# Altium schematic sheet Sheet_1_2021-05-21.schdoc
size 338 x 179 mm
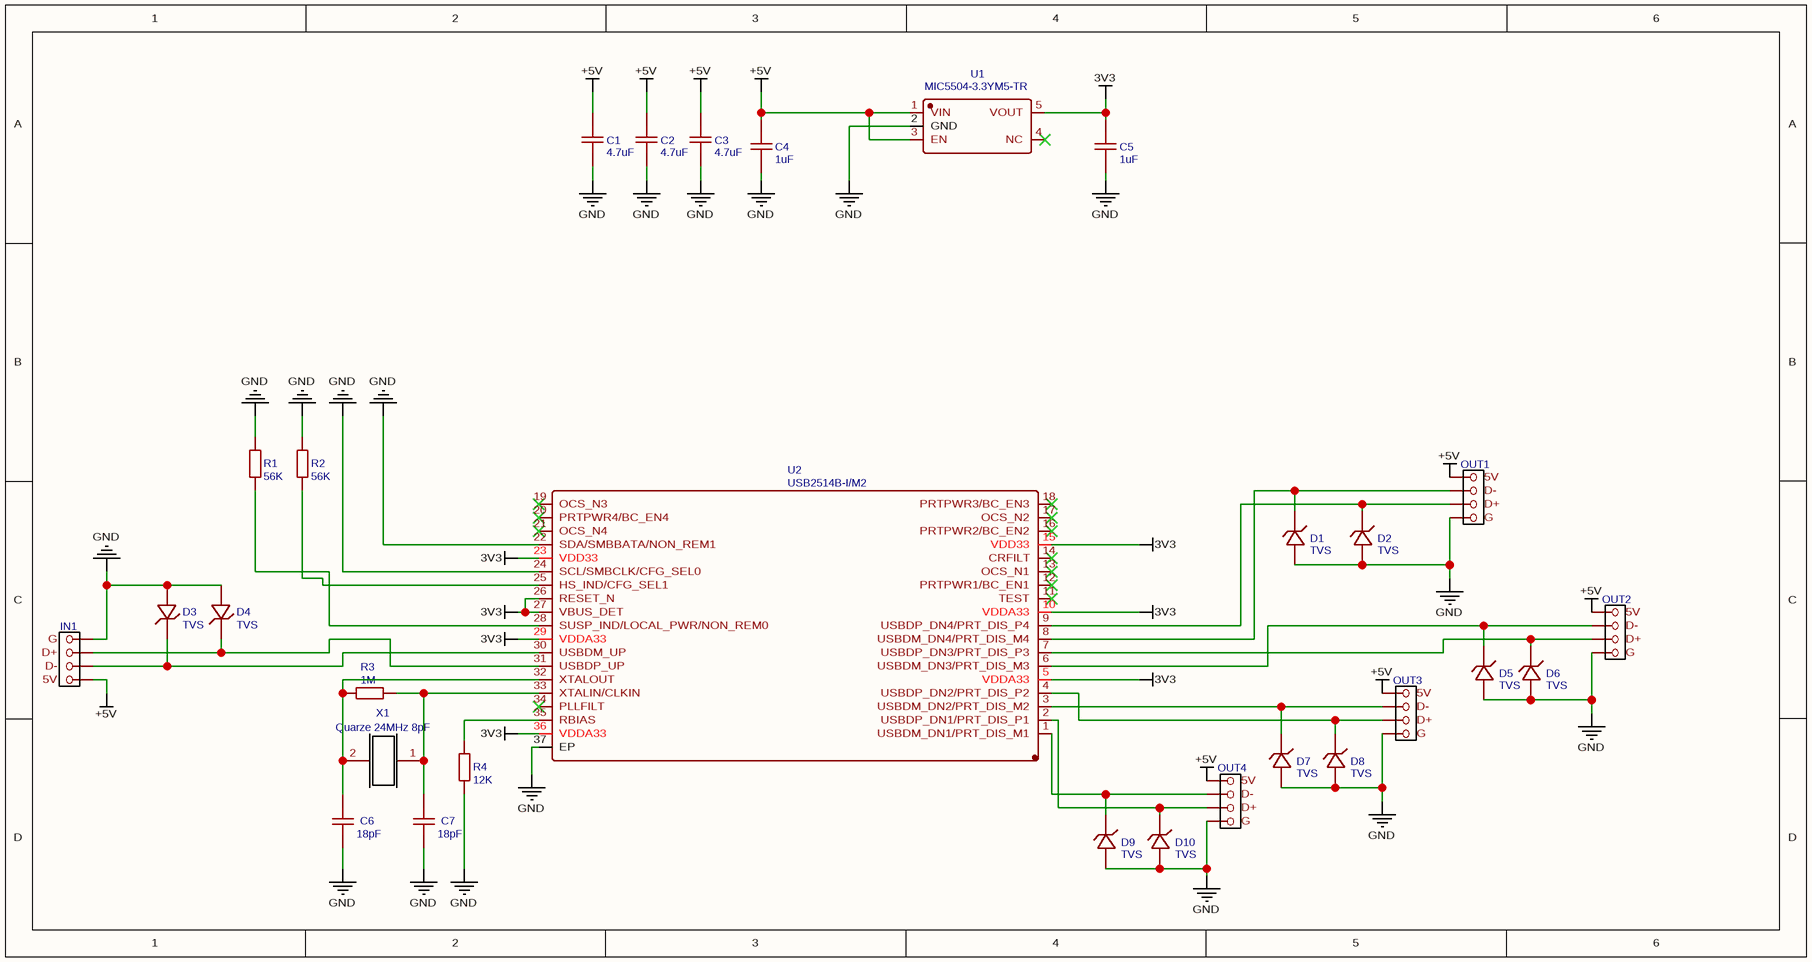
[diagram p0: Sheet_1_2021-05-21.schdoc]

## Parts
C1  4.7uF  [C0603]
C2  4.7uF  [C0603]
C3  4.7uF  [C0603]
C4  1uF  [C0603]
C5  1uF  [C0603]
C6  18pF  [C0603]
C7  18pF  [C0603]
D1  TVS  [DFN1610-2L_L1.6-W1.0-P1.10-RD]
D2  TVS  [DFN1610-2L_L1.6-W1.0-P1.10-RD]
D3  TVS  [DFN1610-2L_L1.6-W1.0-P1.10-RD]
D4  TVS  [DFN1610-2L_L1.6-W1.0-P1.10-RD]
D5  TVS  [DFN1610-2L_L1.6-W1.0-P1.10-RD]
D6  TVS  [DFN1610-2L_L1.6-W1.0-P1.10-RD]
D7  TVS  [DFN1610-2L_L1.6-W1.0-P1.10-RD]
D8  TVS  [DFN1610-2L_L1.6-W1.0-P1.10-RD]
D9  TVS  [DFN1610-2L_L1.6-W1.0-P1.10-RD]
D10  TVS  [DFN1610-2L_L1.6-W1.0-P1.10-RD]
IN1  EXT-JST  [XH-4A]  (value not drawn)
OUT1  EXT-JST  [XH-4A]  (value not drawn)
OUT2  EXT-JST  [XH-4A]  (value not drawn)
OUT3  EXT-JST  [XH-4A]  (value not drawn)
OUT4  EXT-JST  [XH-4A]  (value not drawn)
R1  56K  [R0603]
R2  56K  [R0603]
R3  1M  [R0603]
R4  12K  [R0603]
U1  MIC5504-3.3YM5-TR  [SOT-23-5_L3.0-W1.7-P0.95-LS2.8-TL]
U2  USB2514B-I/M2  [SQFN-36_L6.0-W6.0-P0.50-BL-EP]
X1  Quarze 24MHz 8pF  [24MHZ CRYSTAL]

## Nets
3V3: C5.1 U1.5(VOUT) U2.5(VDDA33) U2.10(VDDA33) U2.15(VDD33) U2.23(VDD33) U2.26(RESET_N) U2.27(VBUS_DET) U2.29(VDDA33) U2.36(VDDA33)
+5V: C1.1 C2.1 C3.1 C4.1 IN1.1(5V) OUT1.1(5V) OUT2.1(5V) OUT3.1(5V) OUT4.1(5V) U1.1(VIN) U1.3(EN)
GND: C1.2 C2.2 C3.2 C4.2 C5.2 C6.1 C7.1 D1.2 D2.2 D3.2 D4.2 D5.2 D6.2 D7.2 D8.2 D9.2 D10.2 IN1.4(G) OUT1.4(G) OUT2.4(G) OUT3.4(G) OUT4.4(G) R1.1 R2.1 R4.2 U1.2(GND) U2.22(SDA/SMBBATA/NON_REM1) U2.24(SCL/SMBCLK/CFG_SEL0) U2.37(EP)
NetC6_2: C6.2 R3.1 U2.32(XTALOUT) X1.2
NetC7_2: C7.2 R3.2 U2.33(XTALIN/CLKIN) X1.1
NetD1_1: D1.1 OUT1.2(D-) U2.8(USBDM_DN4/PRT_DIS_M4)
NetD2_1: D2.1 OUT1.3(D+) U2.9(USBDP_DN4/PRT_DIS_P4)
NetD3_1: D3.1 IN1.2(D-) U2.30(USBDM_UP)
NetD4_1: D4.1 IN1.3(D+) U2.31(USBDP_UP)
NetD5_1: D5.1 OUT2.2(D-) U2.6(USBDM_DN3/PRT_DIS_M3)
NetD6_1: D6.1 OUT2.3(D+) U2.7(USBDP_DN3/PRT_DIS_P3)
NetD7_1: D7.1 OUT3.2(D-) U2.3(USBDM_DN2/PRT_DIS_M2)
NetD8_1: D8.1 OUT3.3(D+) U2.4(USBDP_DN2/PRT_DIS_P2)
NetD9_1: D9.1 OUT4.2(D-) U2.1(USBDM_DN1/PRT_DIS_M1)
NetD10_1: D10.1 OUT4.3(D+) U2.2(USBDP_DN1/PRT_DIS_P1)
NetR1_2: R1.2 U2.28(SUSP_IND/LOCAL_PWR/NON_REM0)
NetR2_2: R2.2 U2.25(HS_IND/CFG_SEL1)
NetR4_1: R4.1 U2.35(RBIAS)

Not connected (* = marked no-connect by the designer): U1 4(NC)*; U2 11(TEST)* 12(PRTPWR1/BC_EN1)* 13(OCS_N1)* 14(CRFILT)* 16(PRTPWR2/BC_EN2)* 17(OCS_N2)* 18(PRTPWR3/BC_EN3)* 19(OCS_N3)* 20(PRTPWR4/BC_EN4)* 21(OCS_N4)* 34(PLLFILT)*

## Library data of the parts
C1-C3 = 4.7uF: nameAlias: Value(F); BOM_Manufacturer Part: ?; spicePre: C; spiceSymbolName: Capacitor; BOM_Supplier: LCSC; BOM_Supplier Part: C1590
C4 C5 = 1uF: nameAlias: Value(F); BOM_Manufacturer Part: ?; spicePre: C; spiceSymbolName: Capacitor; BOM_Supplier: LCSC; BOM_Supplier Part: C1590
C6 C7 = 18pF: nameAlias: Value(F); BOM_Manufacturer Part: ?; spicePre: C; spiceSymbolName: Capacitor; BOM_Supplier: LCSC; BOM_Supplier Part: C1590
D1-D10 = TVS: BOM_Manufacturer: LRC; BOM_Manufacturer Part: LTVS16H12T5G; Contributor: LCSC; BOM_Supplier Part: C172439; BOM_Supplier: LCSC; spicePre: D; spiceSymbolName: LTVS16H12T5G
IN1 OUT1-OUT4 = EXT-JST: Contributor: oliver.mike; BOM_Manufacturer Part: XH-4A; BOM_Supplier Part: XH-4A; BOM_Supplier: EasyEDA; BOM_DataSheet: http://www.jst-mfg.com/product/pdf/eng/eXH.pdf; spicePre: C; spiceSymbolName: JST
R1 R2 = 56K: nameAlias: Value(Ω); BOM_Manufacturer Part: ?; spicePre: R; spiceSymbolName: Resistor; BOM_Supplier: LCSC; BOM_Supplier Part: C25585
R3 = 1M: nameAlias: Value(Ω); BOM_Manufacturer Part: ?; spicePre: R; spiceSymbolName: Resistor; BOM_Supplier: LCSC; BOM_Supplier Part: C25585
R4 = 12K: nameAlias: Value(Ω); BOM_Manufacturer Part: ?; spicePre: R; spiceSymbolName: Resistor; BOM_Supplier: LCSC; BOM_Supplier Part: C25585
U1 = MIC5504-3.3YM5-TR: BOM_Manufacturer: MICROCHIP; Contributor: LCSC; SMT Type: Extend; BOM_Supplier: LCSC; BOM_Manufacturer Part: MIC5504-3.3YM5-TR; BOM_Supplier Part: C88419; BOM_LCSC Assembly: Yes; spicePre: U; spiceSymbolName: MIC5504-3.3YM5-TR
U2 = USB2514B-I/M2: BOM_Manufacturer: Microchip Tech; Contributor: LCSC; BOM_Supplier: LCSC; BOM_Supplier Part: C220679; BOM_Manufacturer Part: USB2514B-I/M2; spicePre: U; spiceSymbolName: USB2514B-I/M2
X1 = Quarze 24MHz 8pF: BOM_Manufacturer Part: ABM10W-24.0000MHZ-8-D1X-T3; Contributor: lalufani; BOM_Supplier Part: 815-10W24-8D1XT; BOM_Supplier: Mouser; spicePre: X; spiceSymbolName: Quarze 24MHz 8pF